# EAGLE design GabozeExpress-Layout (EAGLE 9.4.0)

## Sheet 1 of 9: POWER (SOURCE, BATTERY, CHARGE, CONTROL)
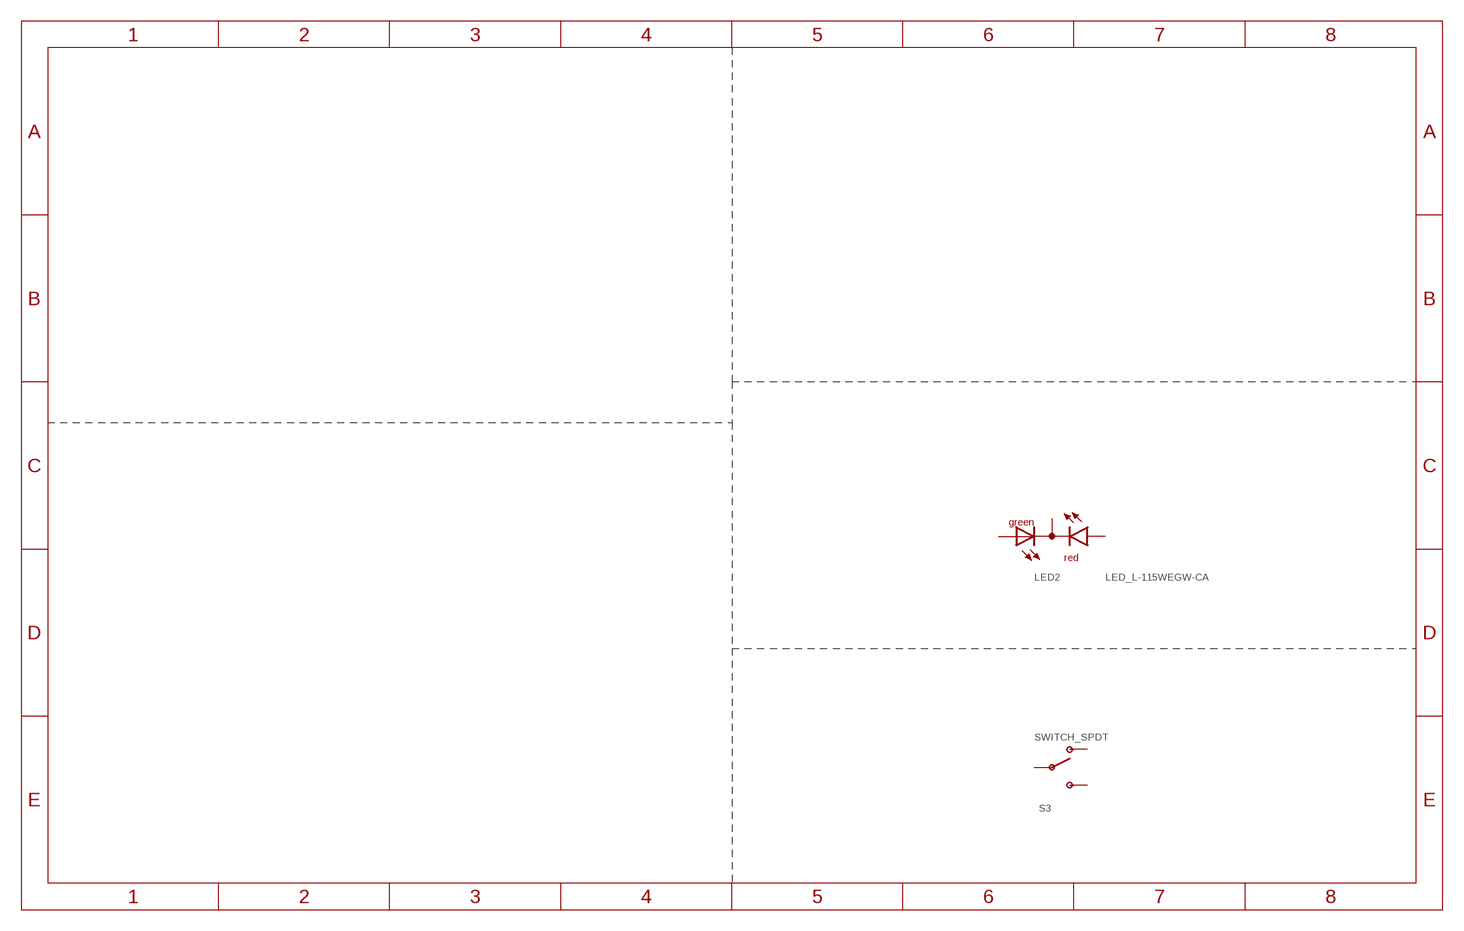
[diagram p0: schematic, sheet 1]

### Parts
LED2  LED_L-115WEGW-CA  [LED_DUOLED-A-3MM]
S3  SWITCH_SPDT  [KPS-1290]
Unconnected: LED2.1(CG) LED2.2(A) LED2.3(CR) S3.O S3.P S3.S

## Sheet 2 of 9: USB UART
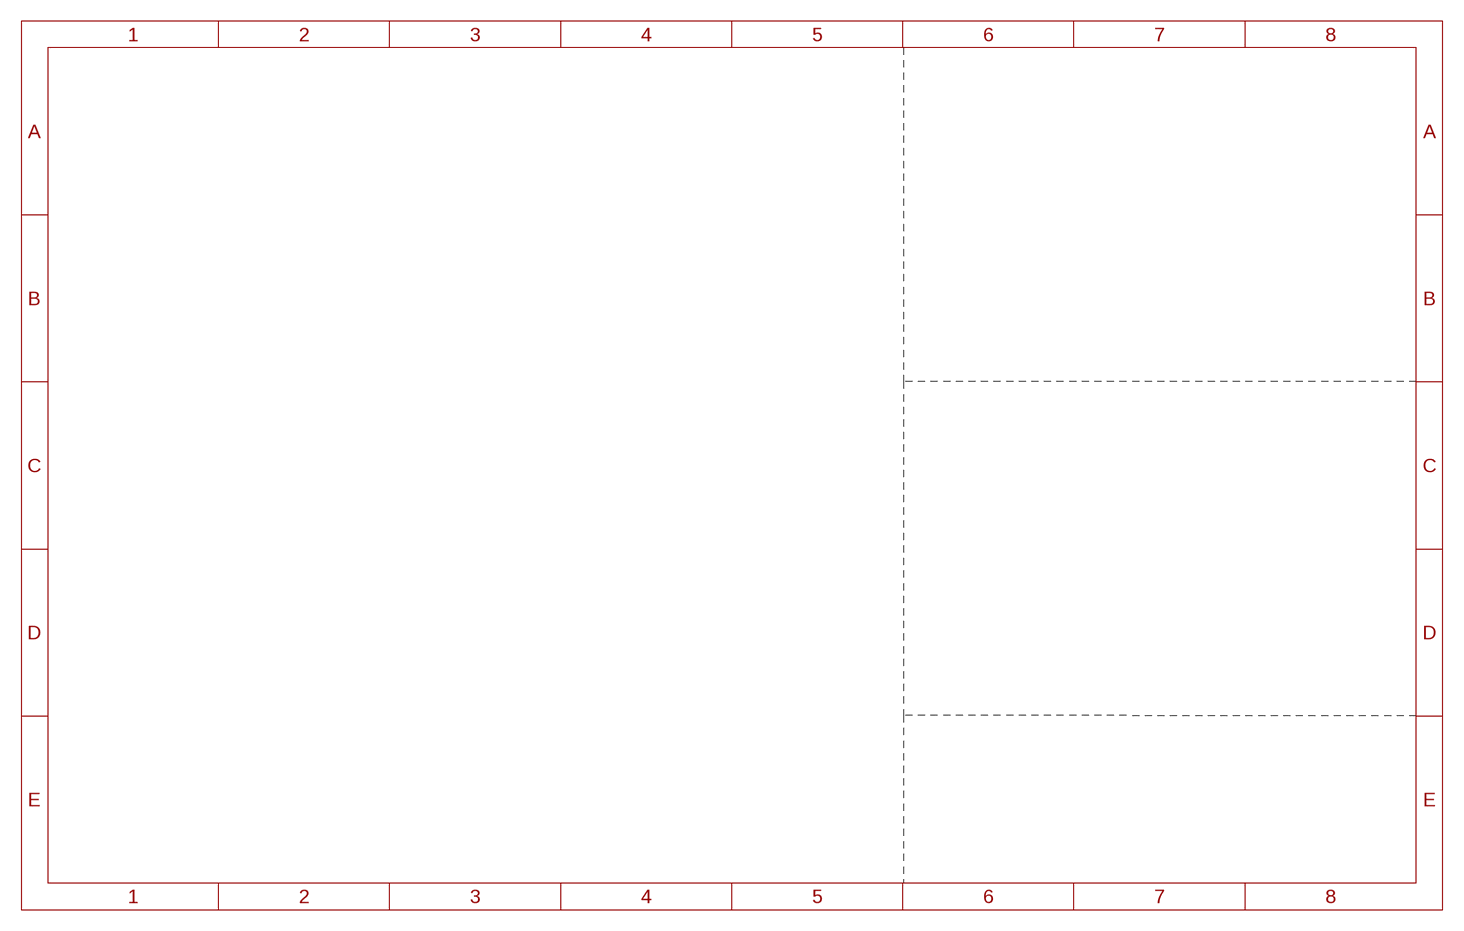
[diagram p1: schematic, sheet 2]

## Sheet 3 of 9: ESP32 CORE
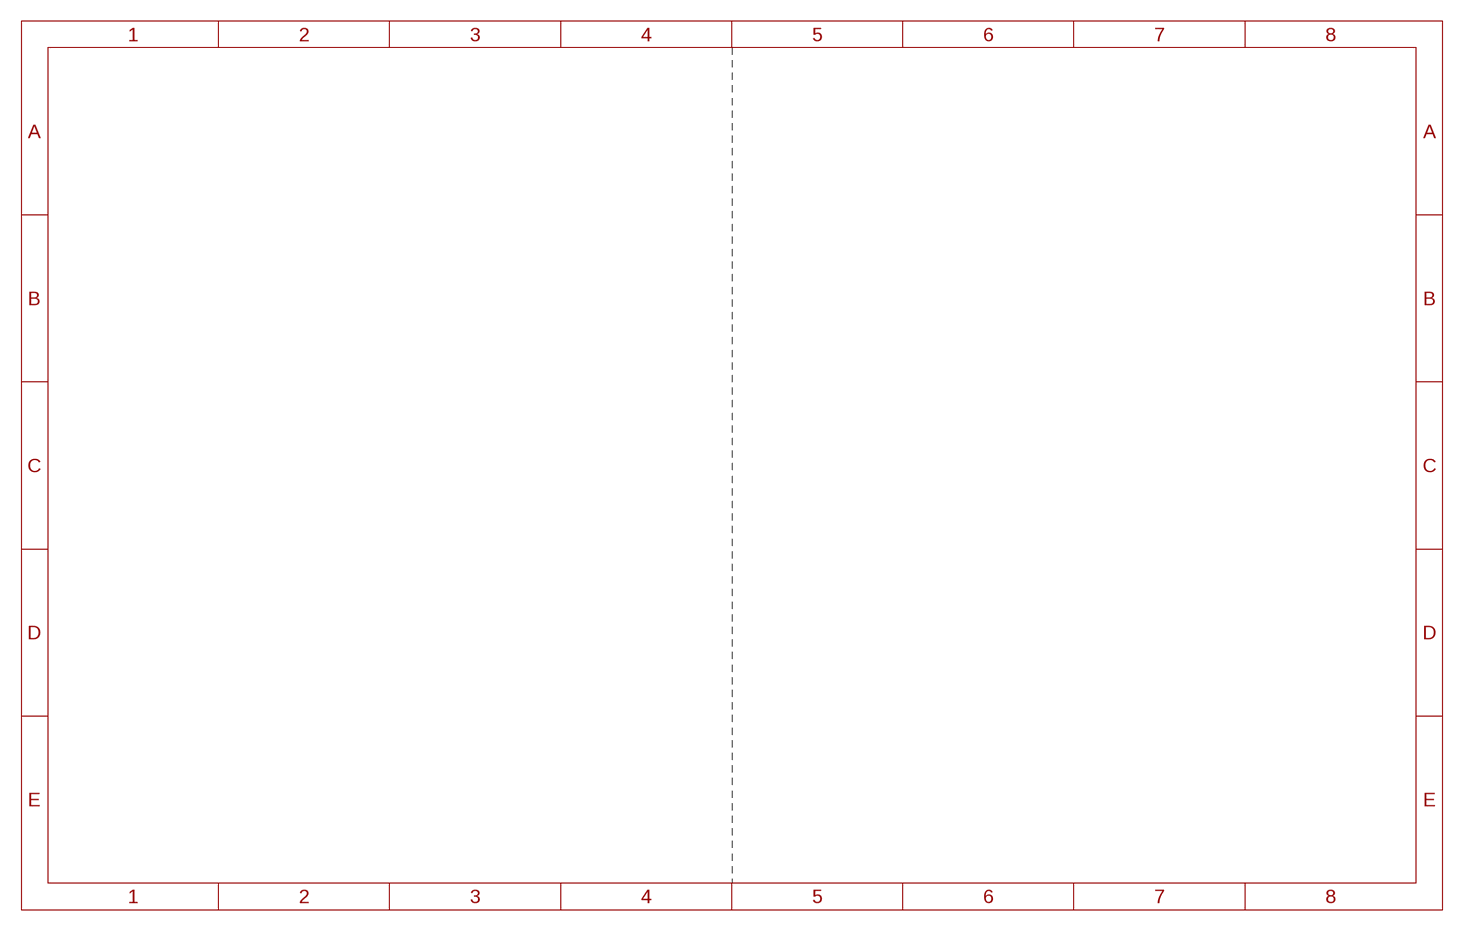
[diagram p2: schematic, sheet 3]

## Sheet 4 of 9: USB + BATTERY
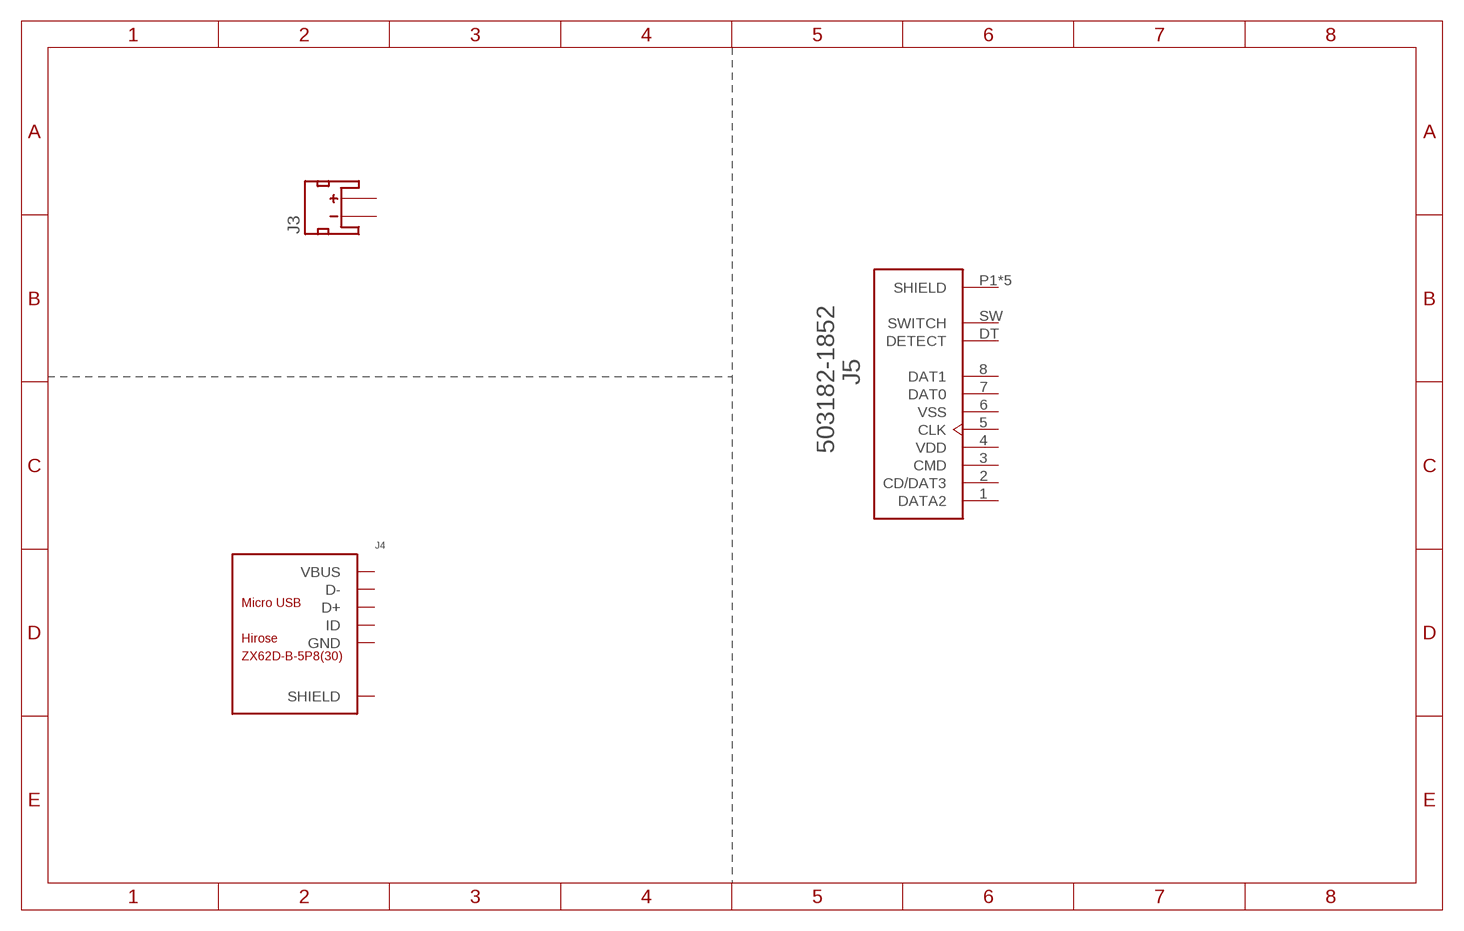
[diagram p3: schematic, sheet 4]

### Parts
J3  Batt Conn  JST_2MM_MALE  [JST-2-SMD]
J4  ZX62D-B-5P8(30)  MICRO-USB-SMD(ZX62D-B-5P8(30))  [MICRO-USB5+6P-SMD-0.65-AB]
J5  503182-1852  [MOLEX_503182-1852]
Unconnected: J3.1(-) J3.2(+) J3.NC1(PAD1) J3.NC2(PAD2) J4.1(VBUS) J4.2(D-) J4.3(D+) J4.4(ID) J4.5(GND) J4.P1(SHIELD) J4.P2(SHIELD) J4.P3(SHIELD) J4.P4(SHIELD) J4.P5(SHIELD) J4.P6(SHIELD) J5.1(DATA2) J5.2(CD/DAT3) J5.3(CMD) J5.5(CLK) J5.7(DAT0) J5.8(DAT1) J5.DT(DETECT) J5.P1(SHIELD) J5.P2(SHIELD) J5.P3(SHIELD) J5.P4(SHIELD) J5.P5(SHIELD) J5.SW(SWITCH)

## Sheet 5 of 9: GPIO
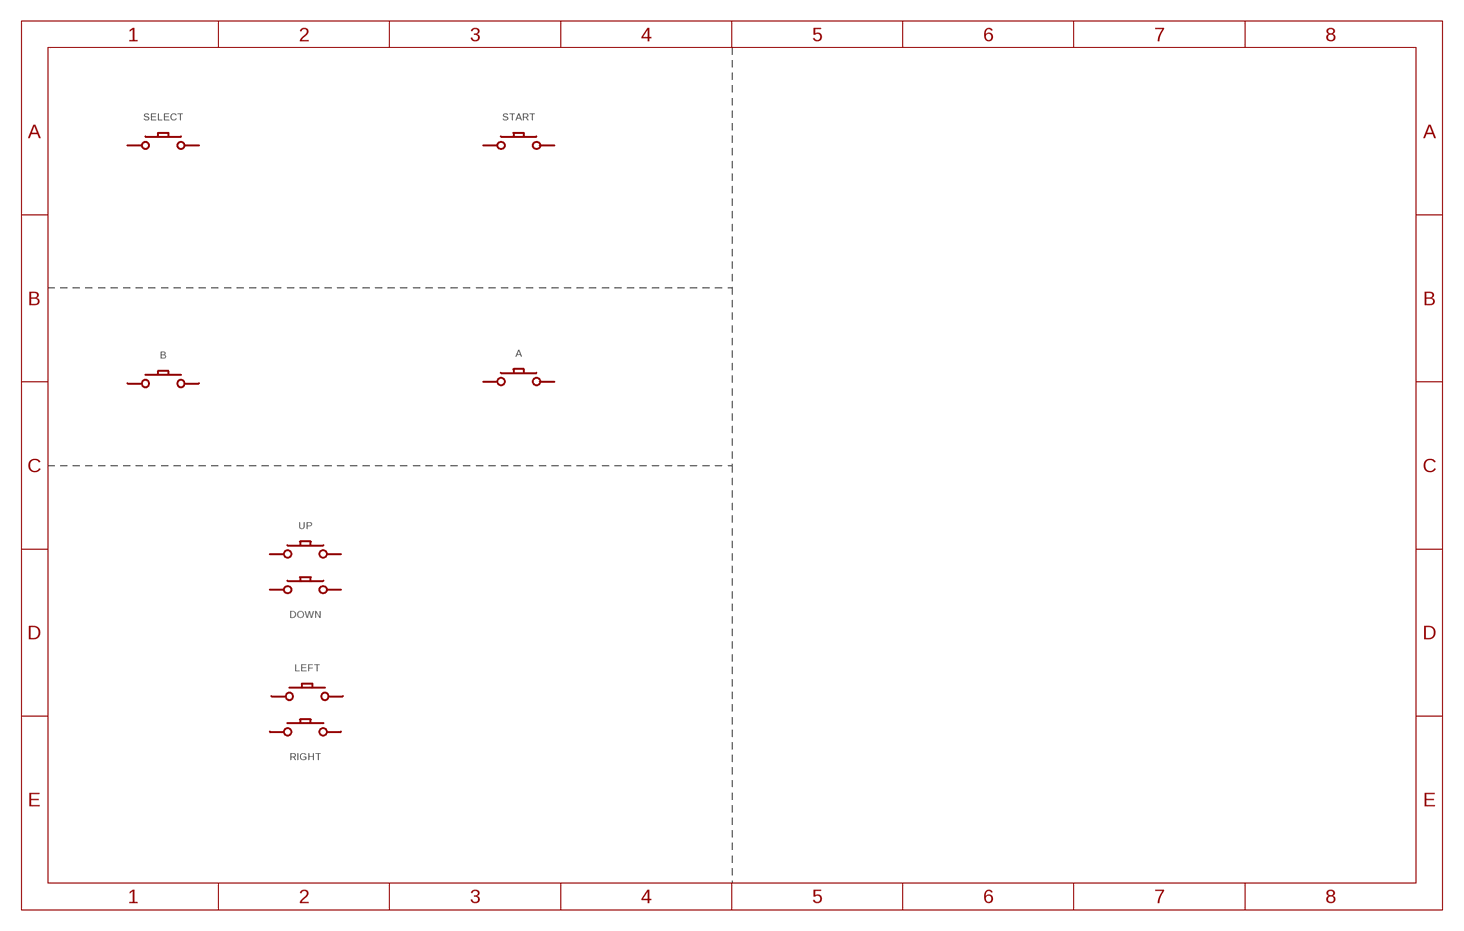
[diagram p4: schematic, sheet 5]

### Parts
A  CONDUCTIVE_BUTTONCONDUCTIVE_BUTTON_THICK  [CONDUCTIVE_BUTTON_THICK]
B  CONDUCTIVE_BUTTONCONDUCTIVE_BUTTON_THICK  [CONDUCTIVE_BUTTON_THICK]
DOWN  CONDUCTIVE_BUTTONCONDUCTIVE_BUTTON_DIRECTIONAL_THICK  [CONDUCTIVE_BUTTON_DIRECTIONAL_THICK]
LEFT  CONDUCTIVE_BUTTONCONDUCTIVE_BUTTON_DIRECTIONAL_THICK  [CONDUCTIVE_BUTTON_DIRECTIONAL_THICK]
RIGHT  CONDUCTIVE_BUTTONCONDUCTIVE_BUTTON_DIRECTIONAL_THICK  [CONDUCTIVE_BUTTON_DIRECTIONAL_THICK]
SELECT  CONDUCTIVE_BUTTON_STARTSELECTCONDUCTIVE_BUTTON_THICK_STARTSELECT  [CONDUCTIVE_BUTTON_THICK_STARTSELECT]
START  CONDUCTIVE_BUTTON_STARTSELECTCONDUCTIVE_BUTTON_THICK_STARTSELECT  [CONDUCTIVE_BUTTON_THICK_STARTSELECT]
UP  CONDUCTIVE_BUTTONCONDUCTIVE_BUTTON_DIRECTIONAL_THICK  [CONDUCTIVE_BUTTON_DIRECTIONAL_THICK]
Unconnected: A.P$ACTIVE A.P$GND B.P$ACTIVE B.P$GND DOWN.P$ACTIVE DOWN.P$GND LEFT.P$ACTIVE LEFT.P$GND RIGHT.P$ACTIVE RIGHT.P$GND SELECT.P$ACTIVE SELECT.P$ACTIVE1(P$ACTIVE) SELECT.P$ACTIVE2(P$ACTIVE) SELECT.P$ACTIVE3(P$ACTIVE) SELECT.P$GND SELECT.P$GND1(P$GND) SELECT.P$GND2(P$GND) SELECT.P$GND3(P$GND) START.P$ACTIVE START.P$ACTIVE1(P$ACTIVE) START.P$ACTIVE2(P$ACTIVE) START.P$ACTIVE3(P$ACTIVE) START.P$GND START.P$GND1(P$GND) START.P$GND2(P$GND) START.P$GND3(P$GND) UP.P$ACTIVE UP.P$GND

## Sheet 6 of 9: SCREEN + BRIGHTNESS
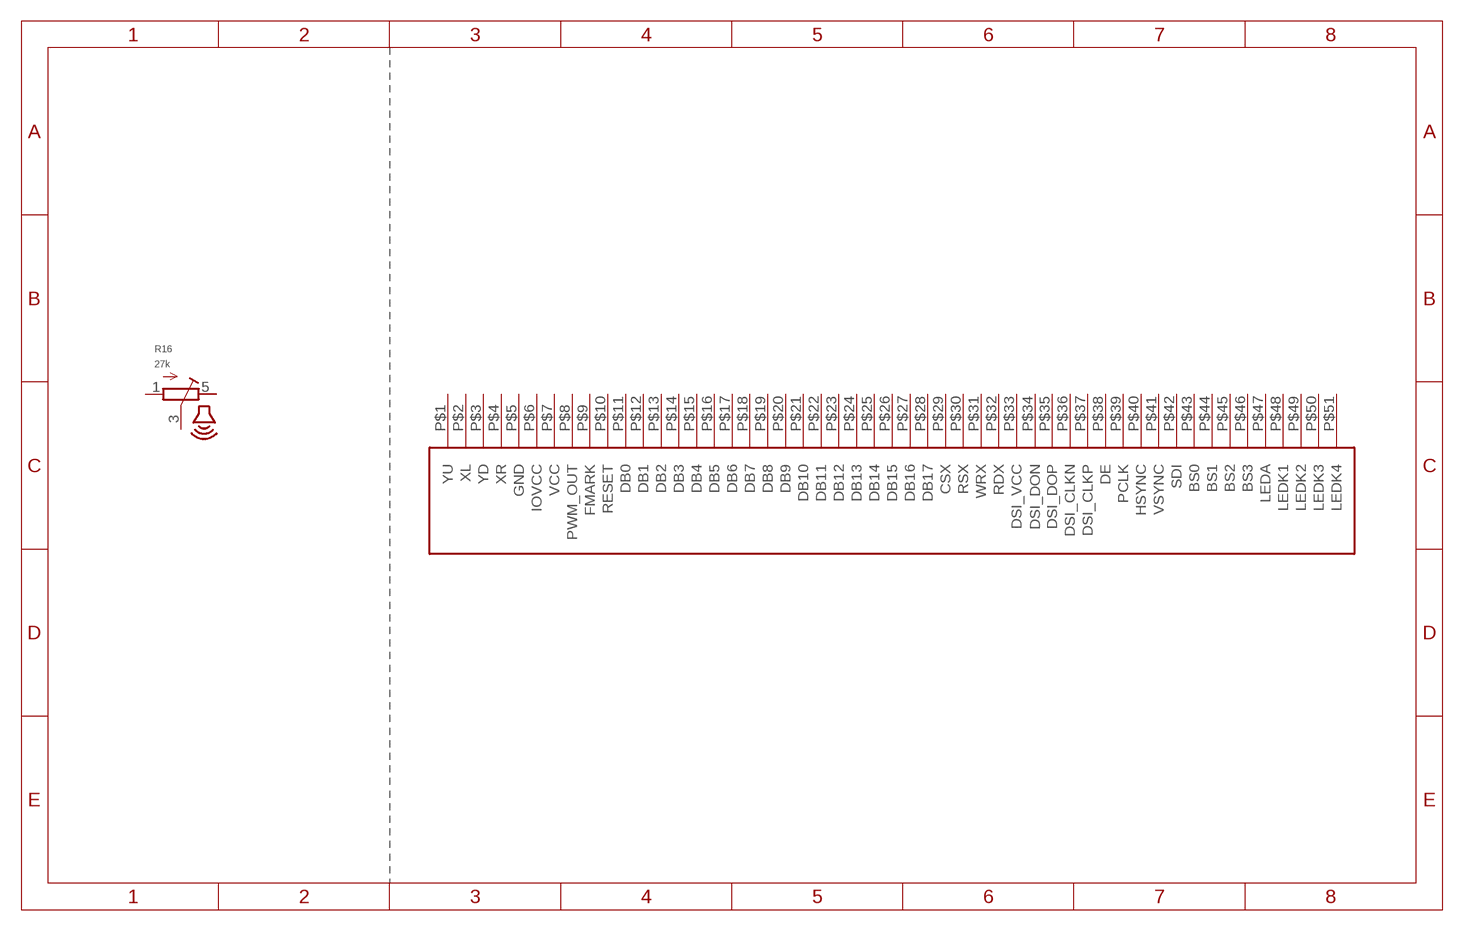
[diagram p5: schematic, sheet 6]

### Parts
R16  27k  GBA_VOLUME  [GBA_VOLUME]
U5  TFT-DISPLAY-2.6-51PIN  [TFT-DISPLAY-2.6-51PIN]
Unconnected: R16.1(A) R16.3(S) R16.5(E) U5.P$1(YU) U5.P$2(XL) U5.P$3(YD) U5.P$4(XR) U5.P$5(GND) U5.P$6(IOVCC) U5.P$7(VCC) U5.P$8(PWM_OUT) U5.P$9(FMARK) U5.P$10(RESET) U5.P$11(DB0) U5.P$12(DB1) U5.P$13(DB2) U5.P$14(DB3) U5.P$15(DB4) U5.P$16(DB5) U5.P$17(DB6) U5.P$18(DB7) U5.P$19(DB8) U5.P$20(DB9) U5.P$21(DB10) U5.P$22(DB11) U5.P$23(DB12) U5.P$24(DB13) U5.P$25(DB14) U5.P$26(DB15) U5.P$27(DB16) U5.P$28(DB17) U5.P$29(CSX) U5.P$30(RSX) U5.P$31(WRX) U5.P$32(RDX) U5.P$33(DSI_VCC) U5.P$34(DSI_DON) U5.P$35(DSI_DOP) U5.P$36(DSI_CLKN) U5.P$37(DSI_CLKP) U5.P$38(DE) U5.P$39(PCLK) U5.P$40(HSYNC) U5.P$41(VSYNC) U5.P$42(SDI) U5.P$43(BS0) U5.P$44(BS1) U5.P$45(BS2) U5.P$46(BS3) U5.P$47(LEDA) U5.P$48(LEDK1) U5.P$49(LEDK2) U5.P$50(LEDK3) U5.P$51(LEDK4)

## Sheet 7 of 9: AUDIO
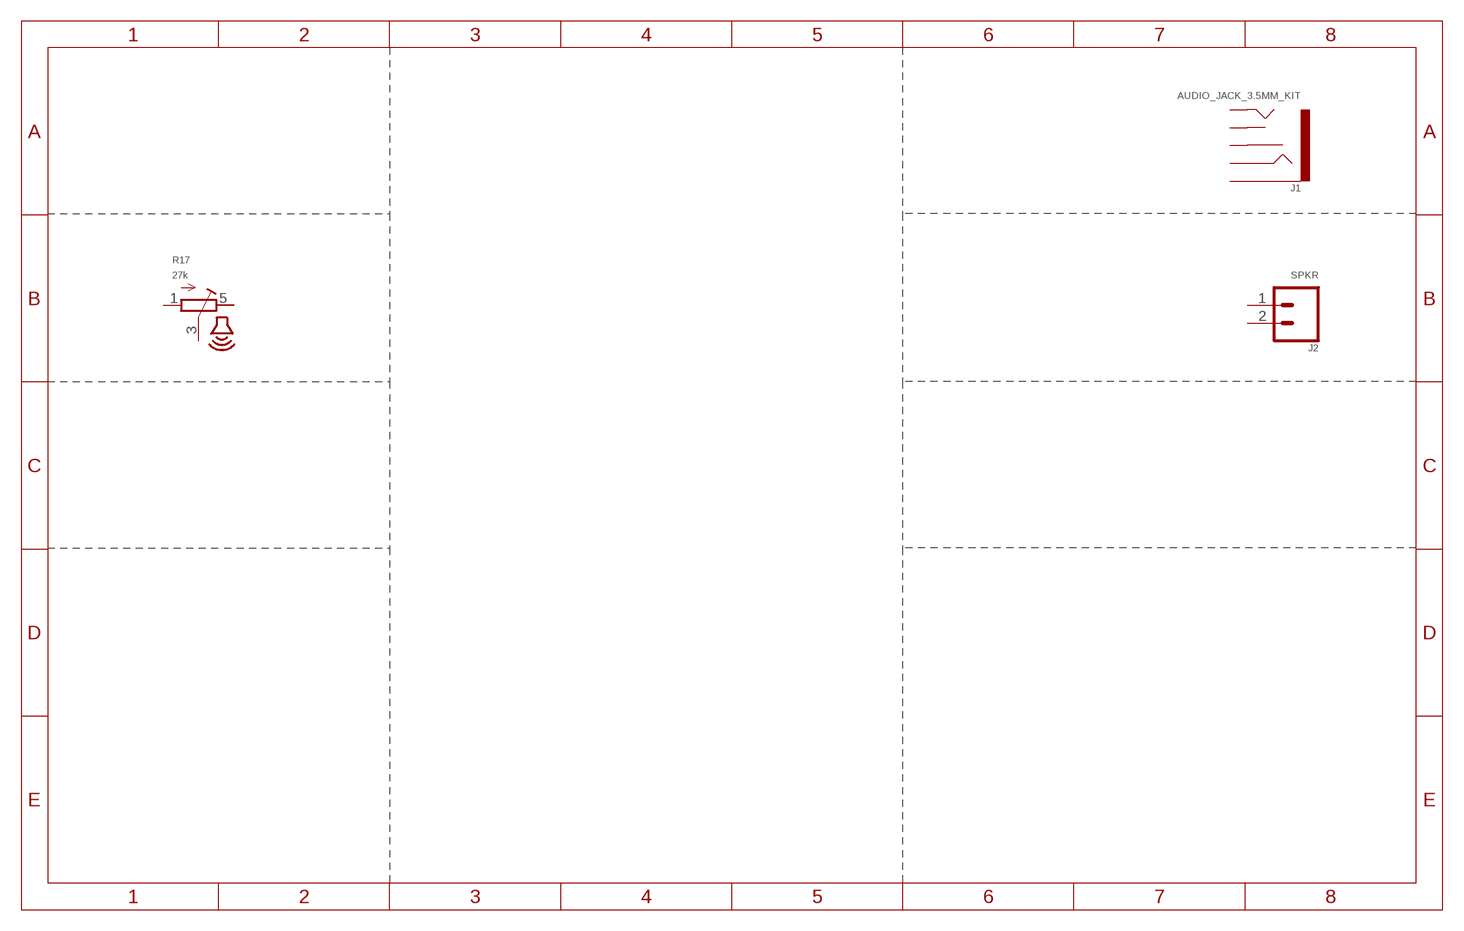
[diagram p6: schematic, sheet 7]

### Parts
J1  AUDIO_JACK_3.5MM_KIT  [AUDIO-JACK-KIT]
J2  SPKR  CONN_02  [1X02]
R17  27k  GBA_VOLUME  [GBA_VOLUME]
Unconnected: J1.RING J1.RSH J1.SLEEVE J1.TIP J1.TSH J2.1 J2.2 R17.1(A) R17.3(S) R17.5(E)

## Sheet 8 of 9: TEST POINTS
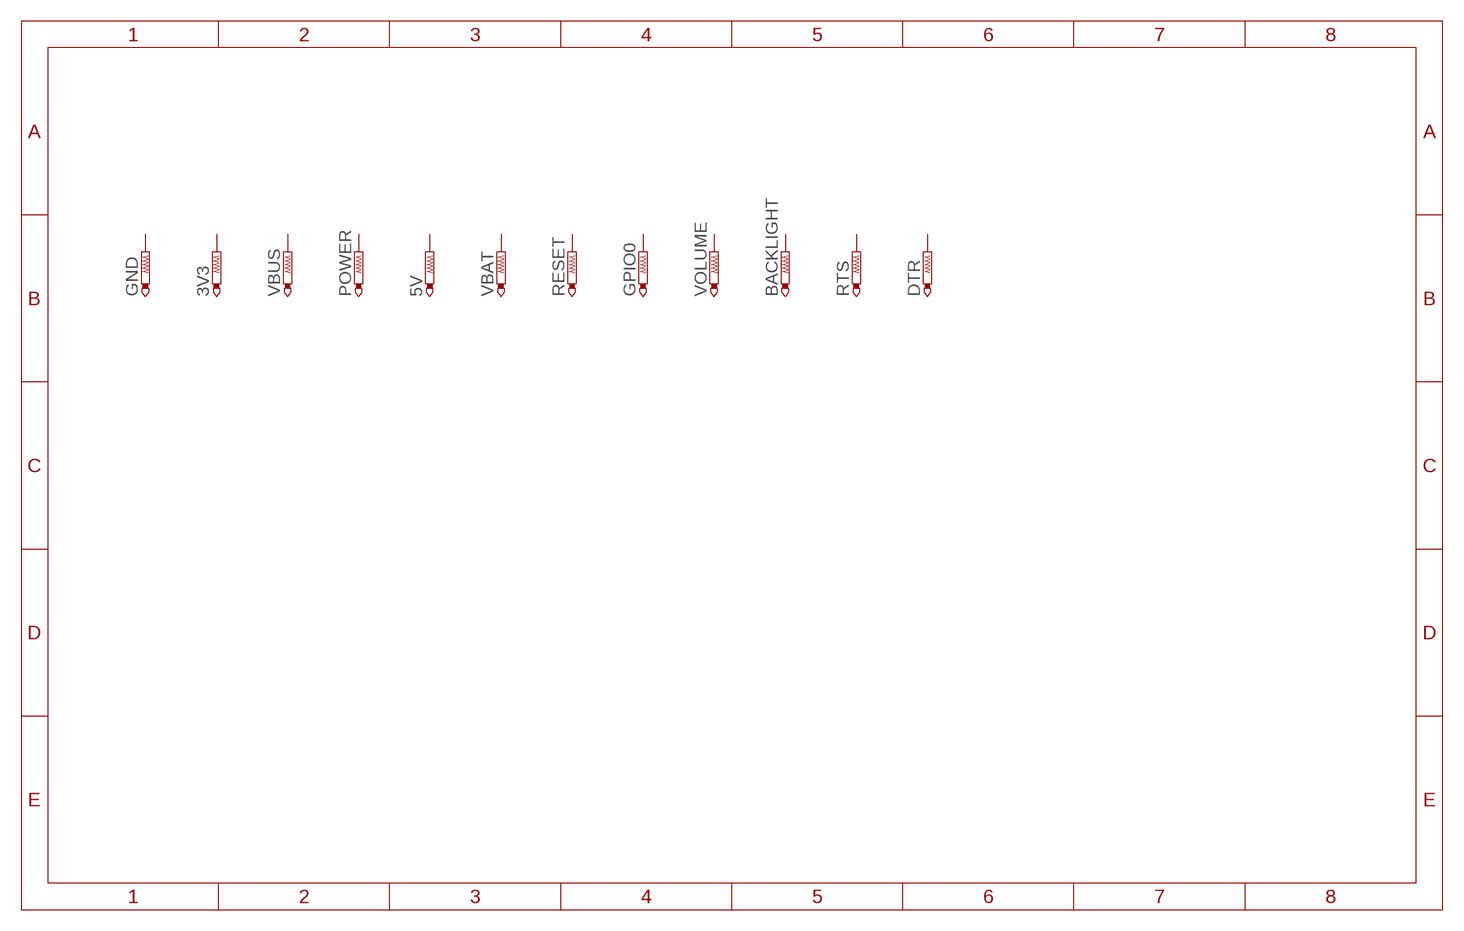
[diagram p7: schematic, sheet 8]

### Parts
3V3  PTR1TP18R  [TP18R]
5V  PTR1TP18R  [TP18R]
BACKLIGHT  PTR1TP18R  [TP18R]
DTR  PTR1TP18R  [TP18R]
GND  PTR1TP18R  [TP18R]
GPIO0  PTR1TP18R  [TP18R]
POWER  PTR1TP18R  [TP18R]
RESET  PTR1TP18R  [TP18R]
RTS  PTR1TP18R  [TP18R]
VBAT  PTR1TP18R  [TP18R]
VBUS  PTR1TP18R  [TP18R]
VOLUME  PTR1TP18R  [TP18R]
Unconnected: 3V3.TP 5V.TP BACKLIGHT.TP DTR.TP GND.TP GPIO0.TP POWER.TP RESET.TP RTS.TP VBAT.TP VBUS.TP VOLUME.TP

## Sheet 9 of 9

## Power pins joined to a net without a drawn wire
VDD: J5.4(VDD)
VSS: J5.6(VSS)

## Library data of the parts
3V3 5V BACKLIGHT DTR GND GPIO0 POWER RESET RTS VBAT VBUS VOLUME = testpad:PTR1: TEST PIN
A B DOWN LEFT RIGHT UP = 32teeth - Conductive Buttons:CONDUCTIVE_BUTTON; IGNORE_BOM: TRUE
J1 = SparkFun-Connectors:AUDIO_JACK_3.5MM: Audio Jack 3.5mm variants of PTH and SMT stereo audio jack with bypass switches. SparkFun Products: SparkFun SparkPunk Sound Kit <[https://www.sparkfun.com/products/11177]> - PTH MP3 Trigger <https://www.sparkfun.com/products/13720> -3.5mm SMD SparkFun PicoBoard <https://www.sparkfun.com/products/11888>- 2.5mm SMD; MPN: SJ1-3525NG-GR; PROD_ID: CONN-08774; SF_ID: PRT-08032
J2 = SparkFun-Connectors:CONN_02: Multi connection point. Often used as Generic Header-pin footprint for 0.1 inch spaced/style header connections On any of the 0.1 inch spaced packages, you can populate with these: Break Away Headers - Straight <https://www.sparkfun.com/products/116> (PRT-00116) Break Away Male Headers - Right Angle <https://www.sparkfun.com/products/553> (PRT-00553) Female Headers <https://www.sparkfun.com/products/115> (PRT-00115) Break Away Headers - Machine Pin <https://www.sparkfun.com/products/117> (PRT-00117) Break Away Female Headers - Swiss Machine Pin <https://www.sparkfun.com/products/743> (PRT-00743) For SCREWTERMINALS and SPRING TERMINALS visit here: Screw Terimnals on SparkFun.com <https://www.sparkfun.com/search/results?term=Screw+Terminals> (5mm/3.5mm/2.54mm spacing) This device is also useful as a general connection point to wire up your design to another part of your project. Our various solder wires solder well into these plated through hole pads. Hook-Up Wire - Assortment (Stranded, 22 AWG) <https://www.sparkfun.com/products/11375> (PRT-11375) Hook-Up Wire - Assortment (Solid Core, 22 AWG) <https://www.sparkfun.com/products/11367> (PRT-11367) View the entire wire category on our website here <https://www.sparkfun.com/categories/141> Special notes: Molex polarized connector foot print use with: PRT-08233 with associated crimp pins and housings. 2.54_SCREWTERM for use with PRT-10571. 3.5mm Screw Terminal footprints for PRT-08084 5mm Screw Terminal footprints for use with PRT-08432
J3 = SparkFun-Connectors:JST_2MM_MALE: JST 2MM MALE RA CONNECTOR Two pin, compact surface mount connector. Commonly used as a battery input connection point. We really like the solid locking feeling and high current rating on these small connectors. We use these all the time as battery connectors. Mates to single-cell LiPo batteries. Here is the connector we sell at SparkFun: JST Right Angle Connector - White <https://www.sparkfun.com/products/8612> (PRT-08612) Datasheet <http://www.sparkfun.com/datasheets/Prototyping/Connectors/JST-Horizontal.pdf> It was used on these SparkFun products: SparkFun MOSFET Power Controller <https://www.sparkfun.com/products/11214> (PRT-11214) SparkFun Battery Babysitter - LiPo Battery Manager <https://www.sparkfun.com/products/13777> (PRT-13777) And many, many others that required a lipo battery connection.; MPN: S2B-PH-SM4-TB(LF)(SN); PROD_ID: CONN-11443; SF_ID: PRT-08612
J4 = Seeed-Connector:MICRO-USB-SMD(ZX62D-B-5P8(30)): 320010005; MPN: ZX62D-B-5P8(30)
J5 = 32teeth  - 503182-1852:503182-1852: Conn Micro SD Card M 8 POS 1.09mm Solder RA SMD Embossed T/R 0.5A/Contact; DESCRIPTION: MICRO SD NORMAL ULTRALOWPRO8CKTE; DIGI-KEY_PART_NUMBER: WM12834CT-ND; DIGI-KEY_PURCHASE_URL: https://www.digikey.ca/product-detail/en/molex/5031821852/WM12834CT-ND/5823232?utm_source=snapeda&utm_medium=aggregator&utm_campaign=symbol; MF: Molex; MP: 5031821852; MPN: 5031821852; PACKAGE: None
LED2 = GabozePocaioGo:LED_L-115WEGW-CA: T-1(3mm) BI-COLOR INDICATOR LAMP Source: Kingbright .. 2_colour_led_.pdf; MPN: SSL-LX3059IGW
R16 R17 = GabozePocaioGo:GBA_VOLUME
S3 = SparkFun-Retired:SWITCH_SPDT: SWCH-10651 Side-actuated SPDT slide switch, as used on the Arduino Pro; MPN: MA12RTR; PROD_ID: SWITCH SLIDE SPDT 300MA 4V
SELECT START = 32teeth - Conductive Buttons:CONDUCTIVE_BUTTON_STARTSELECT; IGNORE_BOM: TRUE
U5 = 32teeth - 2.6" TFT 51P:TFT-DISPLAY-2.6-51PIN: ILI9342 51P 2.6" TFT LCD

## Board
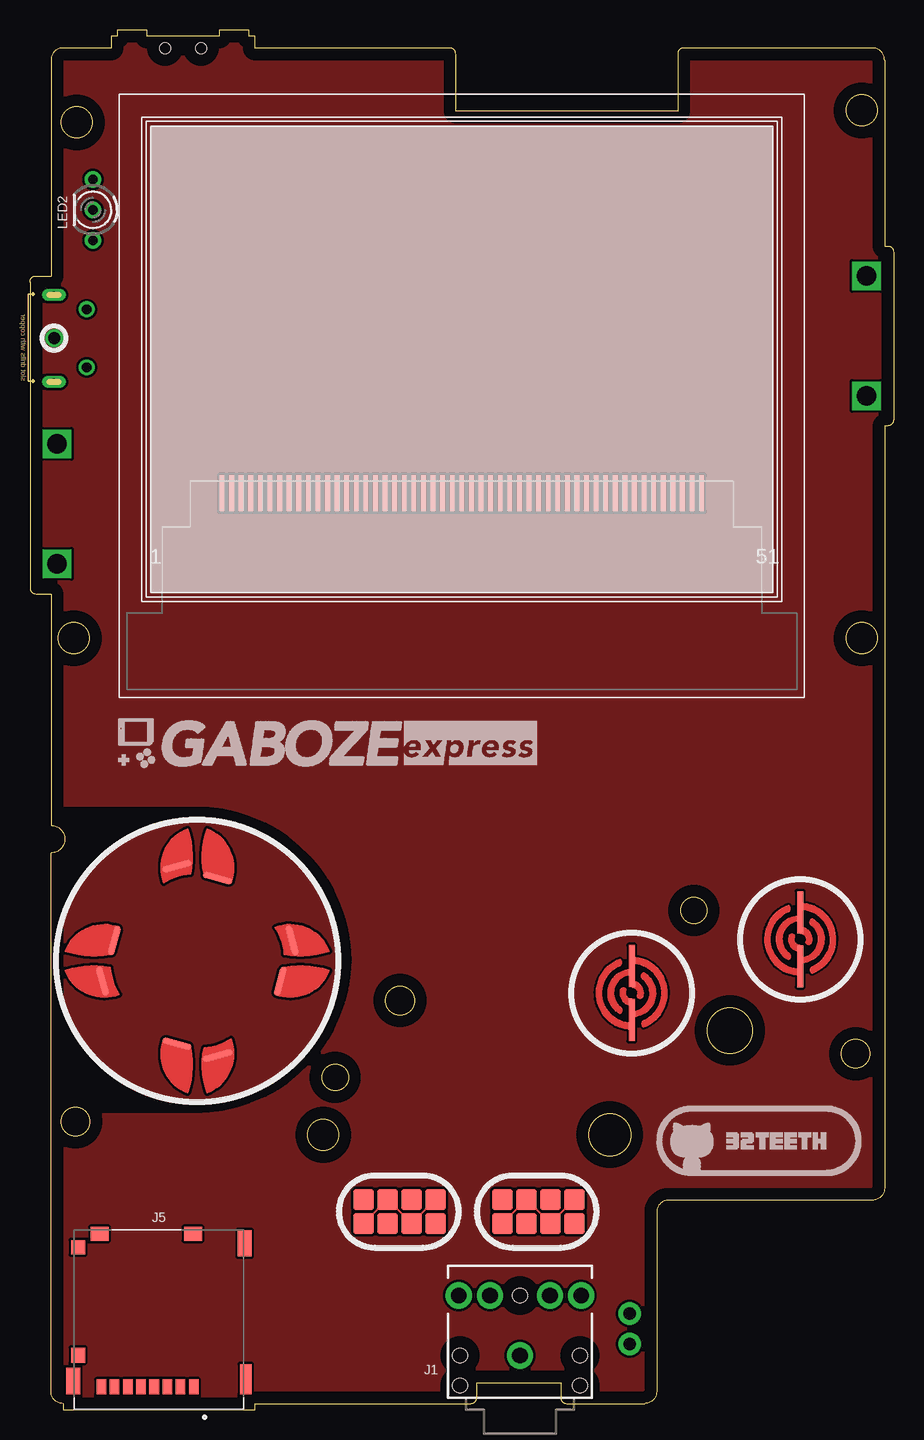
[diagram p8: board, top side]
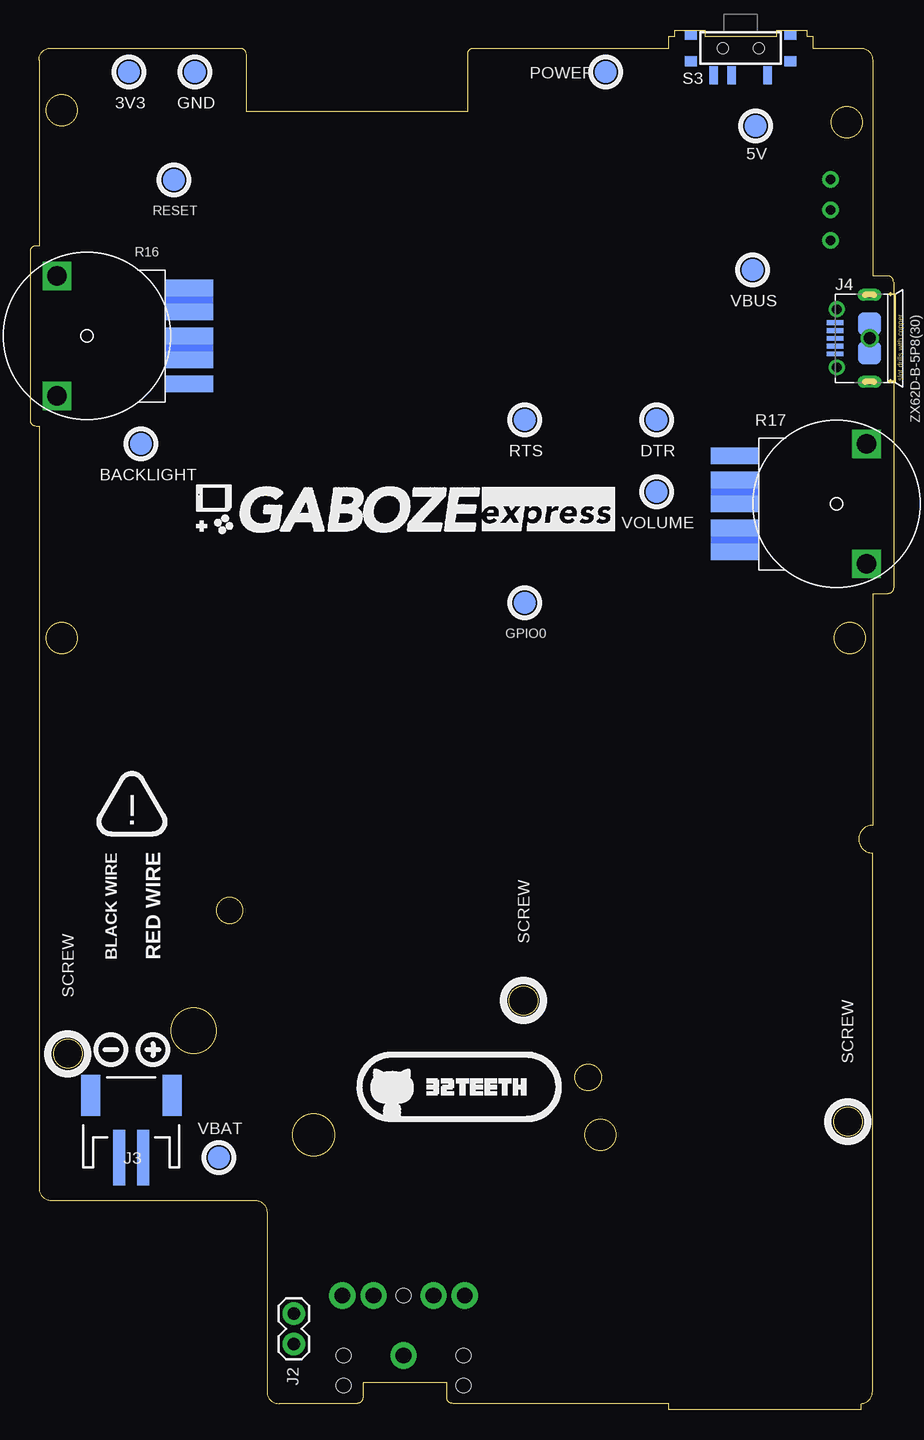
[diagram p9: board, bottom side, seen from below]

Size 72 x 115 mm. Coordinates in mm from the lower left corner, seen from the top.
Outline: 71.25,112.5 71.25,97 71.5,97 arc-90 72,96.5 72,82.5 arc-90 71.5,82 71.25,82 71.25,18.45 arc-90 70.25,17.45 53.25,17.45 arc90 52.25,16.45 52.25,1.5 arc-90 51.25,0.5 44.75,0.5 arc-90 44.25,1 44.25,2.25 37.25,2.25 37.25,1 arc-90 36.75,0.5 18.75,0.5 18.75,0 2.75,0 2.75,0.5 arc-90 1.75,1.5 1.75,46.4 arc180 1.75,48.7 1.75,68 0.5,68 arc-90 0,68.5 0,94 arc-90 0.5,94.5 1.75,94.5 1.75,112.5 arc-90 2.75,113.5 6.75,113.5 6.75,114.5 7.25,114.5 7.25,115 9.75,115 9.75,114.5 15.75,114.5 15.75,115 18.25,115 18.25,114.5 18.75,114.5 18.75,113.5 35,113.5 arc-90 35.5,113 35.5,108.25 54,108.25 54,113 arc-90 54.5,113.5 70.25,113.5 arc-90 71.25,112.5
Outline: circle at 3.8,24 radius 1.2
Outline: circle at 68.85,29.65 radius 1.2
Outline: circle at 58.35,31.6 radius 1.9
Outline: circle at 48.35,22.9 radius 1.75
Outline: circle at 30.85,34.1 radius 1.2
Outline: circle at 25.45,27.7 radius 1.1
Outline: circle at 24.45,22.9 radius 1.3
Outline: circle at 55.35,41.6 radius 1.1
Outline: circle at 69.35,108.3 radius 1.3
Outline: circle at 3.9,107.3 radius 1.3
Outline: circle at 69.35,64.3 radius 1.3
Outline: circle at 3.65,64.3 radius 1.3
Copper layers (1*16): Top 0.035mm / dielectric 1mm / Bottom 0.035mm
Design rules "default *": minimum track width 10mil, minimum drill 24mil, track to track 8mil, track to pad 8mil, pad to pad 8mil, via to via 8mil, smd to smd 8mil, copper to edge 40mil, drill to drill 8mil, minimum pad ring 10mil, minimum via ring 8mil, stop-mask expansion 5mil, vias tented up to drill 10mil, thermal gap 10mil

### Footprints (pad centres in the part's own frame; a part is rotated, then mirrored left to right if it is on the bottom)
TP18R = smd 1.8 x 1.8: TP 0,0
CONDUCTIVE_BUTTON_THICK = smd 0.5 x 3.5: P$ACTIVE 0,-2.25; P$GND 0,2.25
CONDUCTIVE_BUTTON_DIRECTIONAL_THICK = smd 2.5 x 0.5 rotated 75: P$ACTIVE 1.1,1.7 | smd 2.5 x 0.5 rotated 285: P$GND 0.1,-1.7
AUDIO-JACK-KIT = drill 1.3 pad 2.184: RING 5,5.1; RSH 5,2.5; SLEEVE 0,0; TIP 5,-5.1; TSH 5,-2.5 | hole 1.2: 0,5; -2.5,5; -2.5,-5; 0,-5; 5,0
1X02 = drill 1.016 pad 1.88: 1 0,0; 2 2.54,0
JST-2-SMD = smd 1 x 4.6: 1 -1,-3.7; 2 1,-3.7 | smd 1.6 x 3.4: NC1 -3.4,1.5; NC2 3.4,1.5
MICRO-USB5+6P-SMD-0.65-AB = smd 0.4 x 1.35: 1 -1.3,2.875; 2 -0.65,2.875; 3 0,2.875; 4 0.65,2.875; 5 1.3,2.875 | smd 1.9 x 1.9: P1 -1.2,0; P2 1.2,0 | drill 0.508 pad 1.016 long: P3 -3.625,0; P4 3.625,0 | drill 0.8: P5 -2.425,2.73; P6 2.425,2.73
MOLEX_503182-1852 = smd 0.8 x 1.24: 1 -2.9,6.355; 2 -1.8,6.355; 3 -0.7,6.355; 4 0.4,6.355; 5 1.5,6.355; 6 2.6,6.355; 7 3.7,6.355; 8 4.8,6.355 | smd 1.16 x 1.2: DT 6.74,-5.275 | smd 0.95 x 2.5: P1 -7.245,5.725 | smd 1.15 x 2.2: P2 7.145,5.875; P3 -7.145,-5.605 | smd 1.5 x 1.15: P4 -2.84,-6.4; P5 4.94,-6.4 | smd 1.16 x 1.25: SW 6.74,3.725
LED_DUOLED-A-3MM = drill 0.8 pad 1.4: 1 -2.54,0; 2 0,0; 3 2.54,0
GBA_VOLUME = smd 1.4 x 4: 1 -4,-2; 2 -2,-2; 3 0,-2; 4 2,-2; 5 4,-2 | drill 1.6 square: P$6 -5,9; P$7 5,9
KPS-1290 = smd 0.7 x 1.5: O -2.25,2.25; P 0.75,2.25; S 2.25,2.25 | smd 1 x 0.8: P$1 -4.15,1.1; P$2 -4.15,-1.1; P$3 4.15,-1.1; P$4 4.15,1.1 | hole 0.9: -1.5,0; 1.5,0
CONDUCTIVE_BUTTON_THICK_STARTSELECT = smd 1.75 x 1.75: P$ACTIVE 3,1; P$ACTIVE1 -1,1; P$ACTIVE2 -3,-1; P$ACTIVE3 1,-1; P$GND 1,1; P$GND1 -3,1; P$GND2 -1,-1; P$GND3 3,-1
TFT-DISPLAY-2.6-51PIN = smd 0.4 x 3: P$1 -20,-8.12; P$2 -19.2,-8.12; P$3 -18.4,-8.12; P$4 -17.6,-8.12; P$5 -16.8,-8.12; P$6 -16,-8.12; P$7 -15.2,-8.12; P$8 -14.4,-8.12; P$9 -13.6,-8.12; P$10 -12.8,-8.12; P$11 -12,-8.12; P$12 -11.2,-8.12; P$13 -10.4,-8.12; P$14 -9.6,-8.12; P$15 -8.8,-8.12; P$16 -8,-8.12; P$17 -7.2,-8.12; P$18 -6.4,-8.12; P$19 -5.6,-8.12; P$20 -4.8,-8.12; P$21 -4,-8.12; P$22 -3.2,-8.12; P$23 -2.4,-8.12; P$24 -1.6,-8.12; P$25 -0.8,-8.12; P$26 0,-8.12; P$27 0.8,-8.12; P$28 1.6,-8.12; P$29 2.4,-8.12; P$30 3.2,-8.12; P$31 4,-8.12; P$32 4.8,-8.12; P$33 5.6,-8.12; P$34 6.4,-8.12; P$35 7.2,-8.12; P$36 8,-8.12; P$37 8.8,-8.12; P$38 9.6,-8.12; P$39 10.4,-8.12; P$40 11.2,-8.12; P$41 12,-8.12; P$42 12.8,-8.12; P$43 13.6,-8.12; P$44 14.4,-8.12; P$45 15.2,-8.12; P$46 16,-8.12; P$47 16.8,-8.12; P$48 17.6,-8.12; P$49 18.4,-8.12; P$50 19.2,-8.12; P$51 20,-8.12

### Placement (x,y rotation side)
3V3  63.75,111.5 0 bottom
5V  11.5,107 0 bottom
A  64.22,39.2 180 top
B  50.17,34.71 180 top
BACKLIGHT  62.75,80.5 0 bottom
DOWN  13.95,29.4 90 top
DTR  19.75,82.5 0 bottom
GND  58.25,111.5 0 bottom
GPIO0  30.75,67.25 0 bottom
J1  40.85,4.5 90 top
J2  50,8 270 bottom
J3  63.55,24.7 0 bottom
J4  2,89.3 90 bottom
J5  10.75,8.25 180 top
LED2  5.25,100 90 top
LEFT  5.95,37.4 0 top
POWER  24,111.5 0 bottom
R16  60.75,89.5 90 bottom
R17  11.25,75.5 270 bottom
RESET  60,102.5 0 bottom
RIGHT  21.95,37.4 180 top
RTS  30.75,82.5 0 bottom
S3  12.75,113.5 180 bottom
SELECT  30.8,16.51 0 top
START  42.41,16.51 0 top
U5  36,84.5 0 top
UP  13.95,45.4 270 top
VBAT  56.25,21 0 bottom
VBUS  11.75,95 0 bottom
VOLUME  19.75,76.5 0 bottom

### Tracks (layer width: path | path; a pad name or v marks a point on that pad's centre or on a via)
3V3
  pour Top (no thermals): 2.25,37.12 2.25,37.62 arc-90 13.88,49.25 arc-90 25.75,37.38 arc-90 13.88,25.5 arc-90
GND  (via drill 1)
  other vias: 2,89.3
  pour Top (no thermals): 1.75,0.5 2.75,0.5 2.75,0 18.75,0 18.75,0.5 37.25,0.5 37.25,2.25 44.25,2.25 44.25,0.5 52.25,0.5 52.25,17.45 71.25,17.45 71.25,82 72,82 72,97 71.25,97 71.25,113.5 54,113.5 54,108.25 35.5,108.25 35.5,113.5 18.75,113.5 18.75,114.5 18.25,114.5 18.25,115 15.75,115 15.75,114.5 9.75,114.5 9.75,115 7.25,115 7.25,114.5 6.75,114.5 6.75,113.5 1.75,113.5 1.75,94.5 0,94.5 0,68 1.75,68 1.75,50.5 13.75,50.5 arc-90 27,37.5 arc-90 13.75,24.5 1.75,24.5
  pour Bottom (no thermals): 1.75,0.5 2.75,0.5 2.75,0 18.75,0 18.75,0.5 37.25,0.5 37.25,2.25 44.25,2.25 44.25,0.5 52.25,0.5 52.25,17.45 71.25,17.45 71.25,82 72,82 72,97 71.25,97 71.25,113.5 54,113.5 54,108.25 35.5,108.25 35.5,113.5 18.75,113.5 18.75,114.5 18.25,114.5 18.25,115 15.75,115 15.75,114.5 9.75,114.5 9.75,115 7.25,115 7.25,114.5 6.75,114.5 6.75,113.5 1.75,113.5 1.75,94.5 0,94.5 0,68 1.75,68
(copper drawn outside any net)
  shapes: Bottom area x4

### Text on the board
bNames: ! | SCREW | ⇪ | RED WIRE | BLACK WIRE | SCREW | ⇪ | ⇪ | ⇪ | SCREW | ⇪
Reference: Credits: / Name: Eugene Yevhen Andruszczenko / GitHub: 32teeth